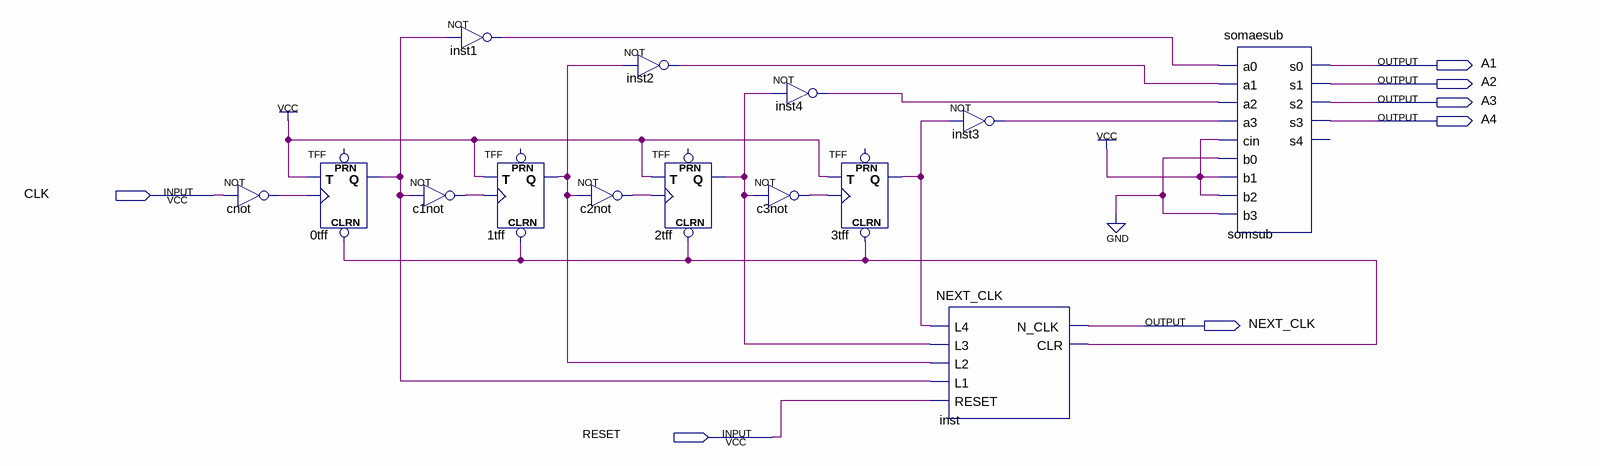
[diagram p0: schematic sheet]
// Quartus schematic counter.bdf as structural Verilog: 14 symbols, 7 pins
module counter (
  input  CLK,
  input  RESET,
  output A1,
  output A2,
  output A3,
  output A4,
  output NEXT_CLK
);

  wire c1not_out, c2not_out, c3not_out, cnot_out, inst1_out, inst2_out, inst3_out, inst4_out, inst_clr,
       n0tff_q, n1tff_q, n2tff_q, n3tff_q;

  not cnot (cnot_out, CLK);
  TFF u_0tff (.CLRN(inst_clr), .T(1'b1), .CLK(cnot_out), .Q(n0tff_q));  // open: PRN
  not inst1 (inst1_out, n0tff_q);
  not c1not (c1not_out, n0tff_q);
  TFF u_1tff (.CLRN(inst_clr), .T(1'b1), .CLK(c1not_out), .Q(n1tff_q));  // open: PRN
  not c2not (c2not_out, n1tff_q);
  not inst2 (inst2_out, n1tff_q);
  TFF u_2tff (.CLRN(inst_clr), .T(1'b1), .CLK(c2not_out), .Q(n2tff_q));  // open: PRN
  not inst4 (inst4_out, n2tff_q);
  not c3not (c3not_out, n2tff_q);
  TFF u_3tff (.CLRN(inst_clr), .T(1'b1), .CLK(c3not_out), .Q(n3tff_q));  // open: PRN
  not inst3 (inst3_out, n3tff_q);
  NEXT_CLK inst (
    .L4(n3tff_q), .L3(n2tff_q), .L2(n1tff_q), .L1(n0tff_q), .RESET(RESET), .N_CLK(NEXT_CLK), .CLR(inst_clr));
  somaesub somsub (
    .a0(inst1_out), .a1(inst2_out), .a2(inst4_out), .a3(inst3_out), .cin(1'b1), .b0(1'b0), .b1(1'b1),
    .b2(1'b1), .b3(1'b0), .s0(A1), .s1(A2), .s2(A3), .s3(A4));  // open: s4
endmodule
